# EAGLE design CMRI-Bus-Interface-L (EAGLE 7.7.0)
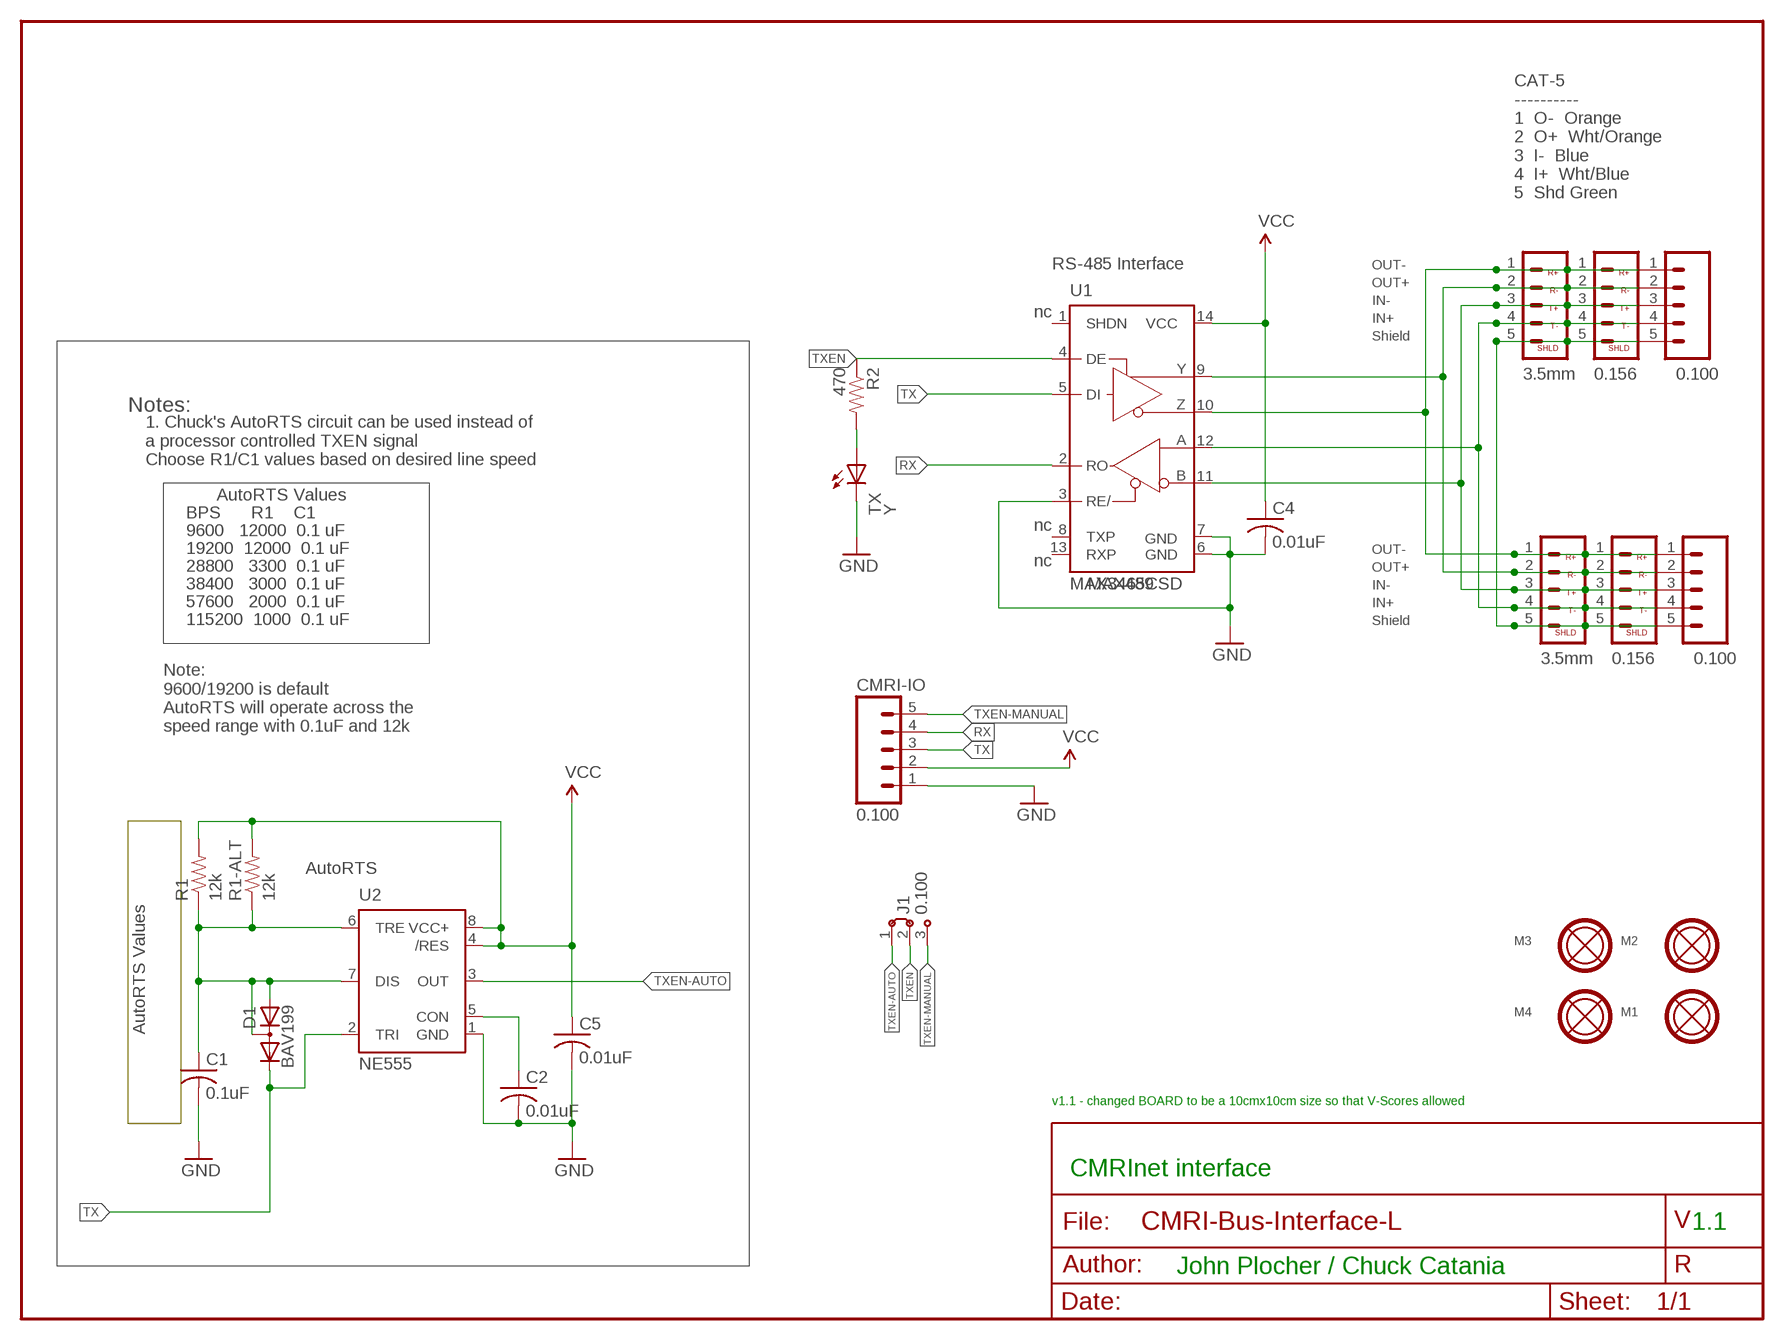
[diagram p0: schematic, sheet 1]

## Parts
C1  0.1uF  CAP0603  [0603-CAP]
C2  0.01uF  CAP0603  [0603-CAP]
C4  0.01uF  CAP0603  [0603-CAP]
C5  0.01uF  CAP0603  [0603-CAP]
CMRI-IO  0.100  CONNECTOR-M05CMRI  [1X05-CMRI-IO]
CMRINET1  3.5mm  CONNECTOR-CMRINET3.5MM  [CMRINET-3.5MM]
CMRINET2  3.5mm  CONNECTOR-CMRINET3.5MM  [CMRINET-3.5MM]
CMRINET3  0.156  CONNECTOR-CMRINET.156  [KK-156-5]
CMRINET4  0.156  CONNECTOR-CMRINET.156  [KK-156-5]
CON1  0.100  CONNECTOR-M05LOCK  [1X05_LOCK]
CON2  0.100  CONNECTOR-M05LOCK  [1X05_LOCK]
D1  BAV199  DIODE-BAV199  [SOT23]
J1  0.100  JUMPER-3-DEFAULT2.54MM  [J3-254]
M1  MOUNTINGHOLE  [MOUNTINGHOLE]
M2  MOUNTINGHOLE  [MOUNTINGHOLE]
M3  MOUNTINGHOLE  [MOUNTINGHOLE]
M4  MOUNTINGHOLE  [MOUNTINGHOLE]
R1  12k  RPTH04  [AXIAL-0.4-RES]
R1-ALT  12k  R0805-RES  [0805-RES]
R2  470  R0805-RES  [0805-RES]
TX  Y  LED0603-LED  [0603-LED]
U1  MAX3465CSD  [SO14]
U2  NE555  NE555D  [SO08]

## Nets
GND: C1.2 C2.2 C4.2 C5.2 CMRI-IO.1 TX.C U1.3(RE/) U1.6(GND) U1.7(GND) U2.1(GND)
IN+: CMRINET1.4 CMRINET2.4 CMRINET3.4 CMRINET4.4 CON1.4 CON2.4 U1.12(A)
IN-: CMRINET1.3 CMRINET2.3 CMRINET3.3 CMRINET4.3 CON1.3 CON2.3 U1.11(B)
N$29: R2.2 TX.A
N$38: C2.1 U2.5(CON)
N$52: C1.1 D1.1(A) D1.3(AC) R1-ALT.1 R1.P$1 U2.6(TRE) U2.7(DIS)
OUT+: CMRINET1.2 CMRINET2.2 CMRINET3.2 CMRINET4.2 CON1.2 CON2.2 U1.9(Y)
OUT-: CMRINET1.1 CMRINET2.1 CMRINET3.1 CMRINET4.1 CON1.1 CON2.1 U1.10(Z)
RX: CMRI-IO.4 U1.2(RO)
SHIELD: CMRINET1.5 CMRINET2.5 CMRINET3.5 CMRINET4.5 CON1.5 CON2.5
TX: CMRI-IO.3 D1.2(C) U1.5(DI) U2.2(TRI)
TXEN: J1.2 R2.1 U1.4(DE)
TXEN-AUTO: J1.1 U2.3(OUT)
TXEN-MANUAL: CMRI-IO.5 J1.3
VCC: C4.1 C5.1 CMRI-IO.2 R1-ALT.2 R1.P$2 U1.14(VCC) U2.4(/RES) U2.8(VCC+)
Unconnected: U1.1(SHDN) U1.8(TXP) U1.13(RXP)

## Notes on the sheet
- CAT-5
  ----------
  1  O-  Orange
  2  O+  Wht/Orange
  3  I-  Blue
  4  I+  Wht/Blue
  5  Shd Green
- RS-485 Interface | OUT-
- OUT+
- nc | IN-
- IN+
- Shield
- Notes:
- 1. Chuck's AutoRTS circuit can be used instead of 
  a processor controlled TXEN signal
  Choose R1/C1 values based on desired line speed
- AutoRTS Values
- BPS      R1    C1 | nc
- 9600   12000  0.1 uF
- 19200  12000  0.1 uF | nc | OUT-
- 28800   3300  0.1 uF | OUT+
- 38400   3000  0.1 uF | MAX489 | IN-
- 57600   2000  0.1 uF | IN+
- 115200  1000  0.1 uF | Shield
- Note: 
  9600/19200 is default
  AutoRTS will operate across the
  speed range with 0.1uF and 12k
- AutoRTS
- AutoRTS Values
- v1.1 - changed BOARD to be a 10cmx10cm size so that V-Scores allowed
- CMRInet interface
- 1.1
- John Plocher / Chuck Catania

## Library data of the parts
C1 C2 C4 C5 = SPCoast:CAP*
CMRI-IO CON1 CON2 = SPCoast:CONNECTOR-M05: Header 5 Standard 5-pin 0.1" header. Use with straight break away headers (SKU : PRT-00116), right angle break away headers (PRT-00553), swiss pins (PRT-00743), machine pins (PRT-00117), and female headers (PRT-00115). Molex polarized connector foot print use with SKU : PRT-08230 with associated crimp pins and housings.
CMRINET1-CMRINET4 = SPCoast:CONNECTOR-CMRINET: CMRINet Top 3.5mm Screw Terminal 5 pos
D1 = SPCoast:DIODE-BAV199: DIODE low-leakage double diode
J1 = SPCoast:JUMPER-3-DEFAULT: Jumper switch 2 x 2.5 mm
M1-M4 = SPCoast:MOUNTINGHOLE: Mounting hole with top and bottom copper and stop rings
R1 R1-ALT R2 = SPCoast:R*: Resistor Basic schematic elements and footprints for 0603, 1206, and PTH 1/10th watt (small) resistors.
TX = SPCoast:LED*
U1 = SPCoast:MAX346*: +5V, Fail-Safe, 40Mbps, Profibus RS-485/RS-422 Transceivers Source: MAX3465-MAX3469.pdf; MPN: MAX3465CSD+; OC_FARNELL: unknown; OC_NEWARK: 65K6814
U2 = SPCoast:NE555: General purpose bipolar Timer

## Board
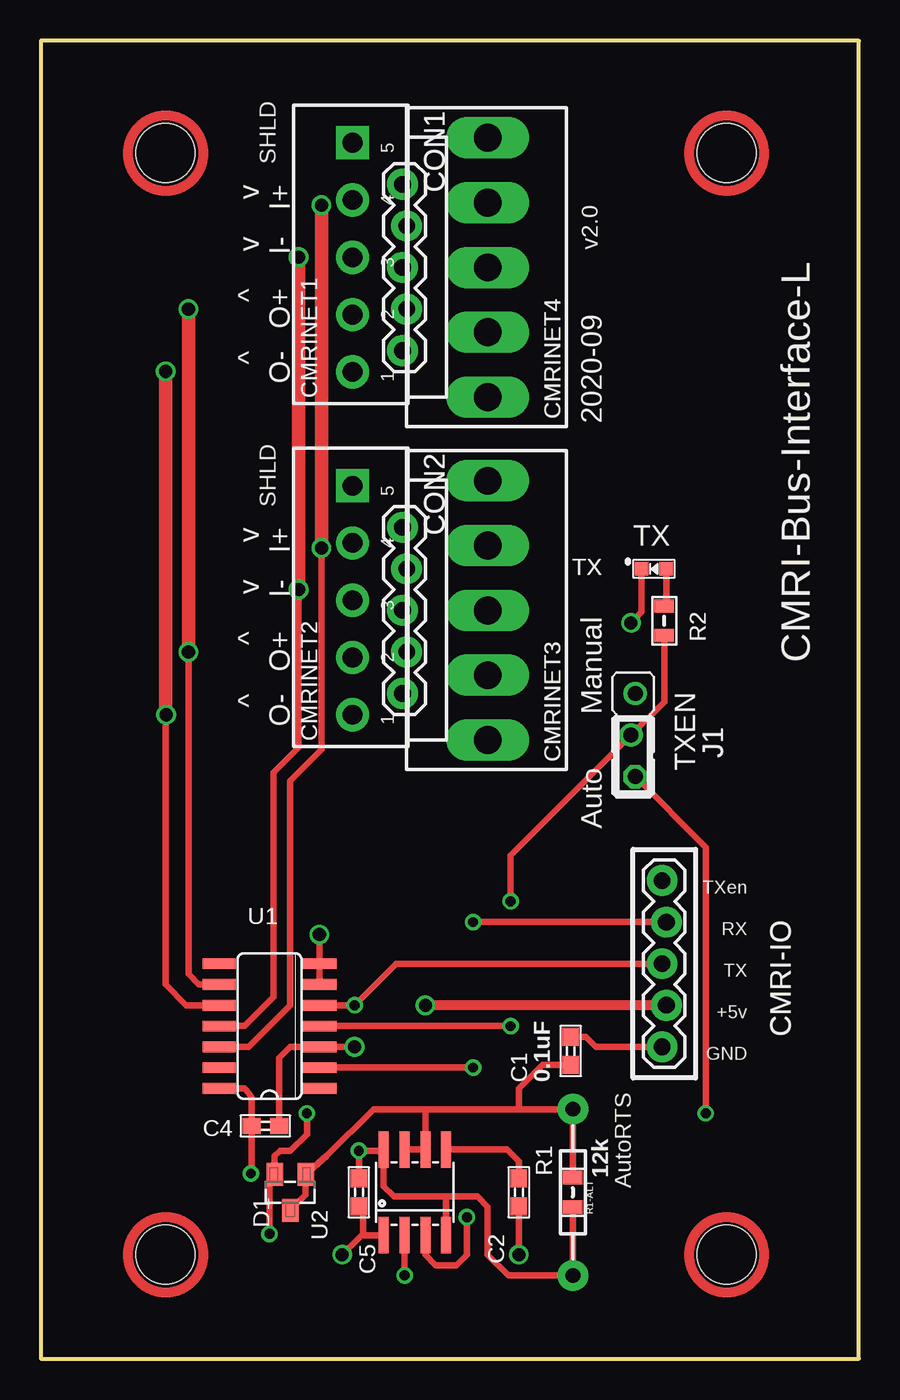
[diagram p1: board, top side]
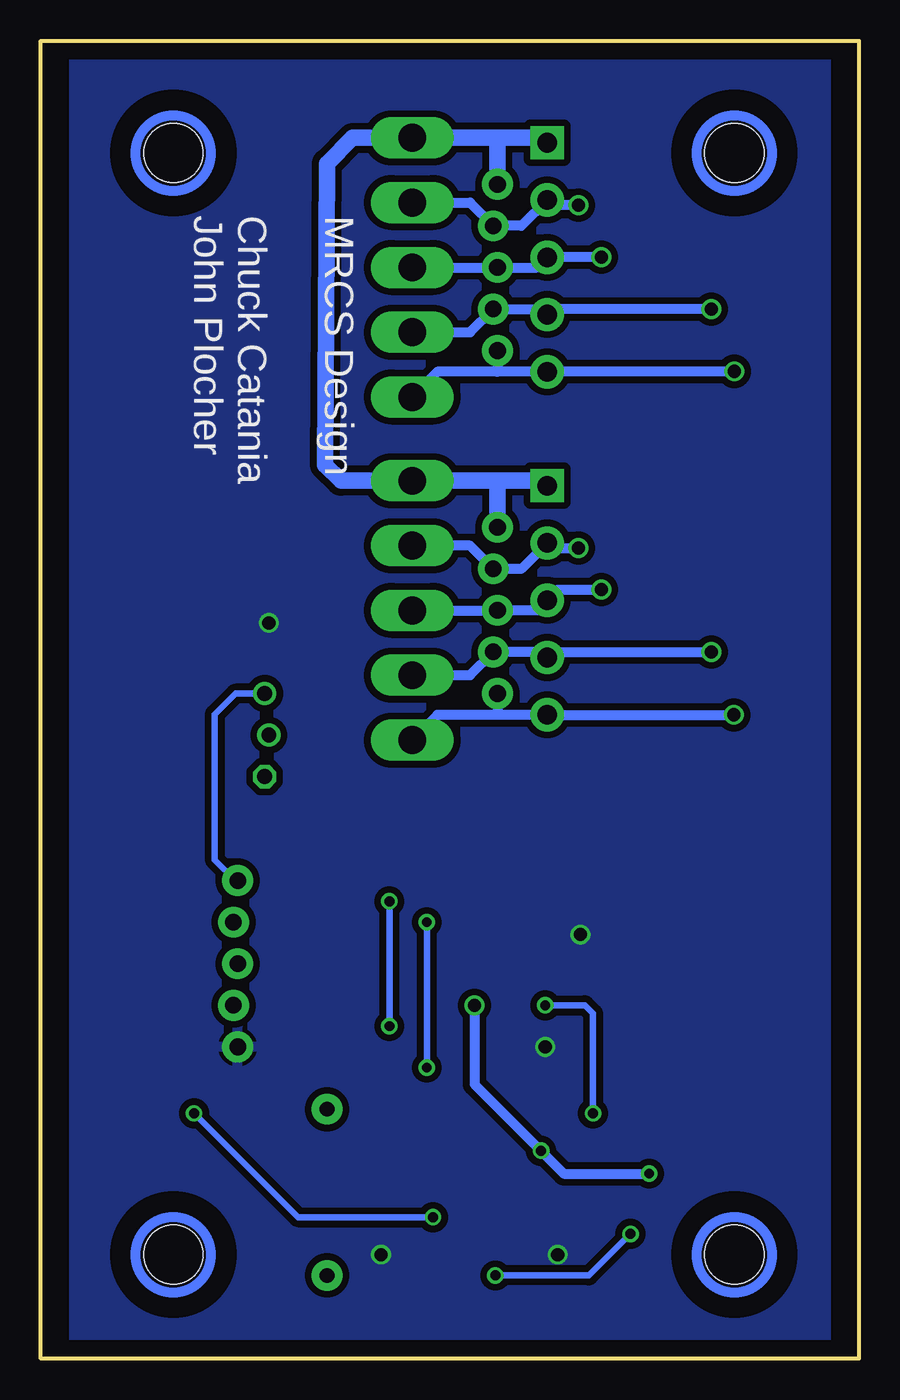
[diagram p2: board, bottom side, seen from below]

Size 50 x 80.52 mm. Coordinates in mm from the lower left corner, seen from the top.
Outline: 0,0 50,0 50,80.52 0,80.52 0,0
Copper layers (1*16): Top 0.035mm / dielectric 1.5mm / Bottom 0.035mm
Design rules "default": minimum track width 10mil, minimum drill 0.6mm, track to track 8mil, track to pad 8mil, pad to pad 8mil, via to via 8mil, smd to smd 8mil, copper to edge 40mil, drill to drill 8mil, minimum pad ring 10mil, minimum via ring 8mil, stop-mask expansion 4mil, vias tented up to drill 0mil, thermal gap 10mil

### Footprints (pad centres in the part's own frame; a part is rotated, then mirrored left to right if it is on the bottom)
0603-CAP = smd 1.1 x 1: 1 -0.85,0; 2 0.85,0
1X05-CMRI-IO = drill 1.016 pad 1.88: 1 0,0.127; 2 2.54,-0.127; 3 5.08,0.127; 4 7.62,-0.127; 5 10.16,0.127
CMRINET-3.5MM = drill 1.2 pad 2.032: 1 -6.38,0; 2 -2.88,0; 3 0.62,0; 4 4.12,0 | drill 1.2 pad 2.032 square: 5 7.62,0
KK-156-5 = drill 1.7 pad 2.184 long: 1 -7.92,0; 2 -3.96,0; 3 0,0; 4 3.96,0; 5 7.92,0
1X05_LOCK = drill 1.016 pad 1.88: 1 0,0.127; 2 2.54,-0.127; 3 5.08,0.127; 4 7.62,-0.127; 5 10.16,0.127
SOT23 = smd 1.4 x 1: 1 1.1,-0.95; 2 1.1,0.95; 3 -1.1,0
J3-254 = drill 0.914 octagon: 1 -2.54,-0.127 | drill 0.914: 2 0,0.127; 3 2.54,-0.127
MOUNTINGHOLE = hole 3.6: 0,0
AXIAL-0.4-RES = drill 0.9 pad 1.88: P$1 -5.08,0; P$2 5.08,0
0805-RES = smd 0.8 x 1.2: 1 -0.9,0; 2 0.9,0
0603-LED = smd 0.8 x 0.8: A 0.75,0; C -0.75,0
SO14 = smd 0.66 x 2.032: 1 -3.81,-3.073; 2 -2.54,-3.073; 3 -1.27,-3.073; 4 0,-3.073; 5 1.27,-3.073; 6 2.54,-3.073; 7 3.81,-3.073; 8 3.81,3.073; 9 2.54,3.073; 10 1.27,3.073; 11 0,3.073; 12 -1.27,3.073; 13 -2.54,3.073; 14 -3.81,3.073
SO08 = smd 0.61 x 2.21: 1 -1.905,-2.616; 2 -0.635,-2.616; 3 0.635,-2.616; 4 1.905,-2.616; 5 1.905,2.616; 6 0.635,2.616; 7 -0.635,2.616; 8 -1.905,2.616

### Placement (x,y rotation side)
C1  32.38,18.8 90 top
C2  29.21,10.16 270 top
C4  13.72,14.22 0 top
C5  19.43,10.16 270 top
CMRI-IO  38.1,19.05 90 top
CMRINET1  19.05,66.67 90 top
CMRINET2  19.05,45.72 90 top
CMRINET3  27.3,45.72 90 top
CMRINET4  27.3,66.67 90 top
CON1  22.23,61.59 90 top
CON2  22.23,40.64 90 top
D1  15.24,10.16 90 top
J1  36.2,38.1 90 top
M1  7.62,6.35 0 top
M2  7.62,73.66 0 top
M3  41.91,6.35 0 top
M4  41.91,73.66 0 top
R1  32.51,10.16 270 top
R1-ALT  32.51,10.16 270 top
R2  38.1,45.09 90 top
TX  37.47,48.26 0 top
U1  13.97,20.32 90 top
U2  22.86,10.16 0 top

### Tracks (layer width: path | path; a pad name or v marks a point on that pad's centre or on a via)
GND  (via drill 0.8)
  Top 0.406: U1.6 U1.7 17.04,25.41 17.04,25.9 17.04,25.91 v17.02,25.91 | C2.2 v29.21,6.35 | C5.2 19.7,9.31 19.7,7.61 19.76,7.54 | U2.1 19.76,7.54 | 19.76,7.54 19.61,7.54 v18.41,6.35 | C1.2 33.31,19.65 33.91,19.05 CMRI-IO.1 | v19.18,19.05 U1.3 15.24,19.05 14.57,18.38 C4.2 | TX.C 36.72,45.6 v36.07,44.96
  pour Bottom (isolate 0.406): 2,80.52 48,80.52 48,0 2,0
IN+  (via drill 0.8)
  Top 0.406: U1.12 12.7,19.05 15.24,21.59 15.24,35.31 17.14,37.21 v17.14,49.53
  Top 0.813: v17.14,49.53 v17.14,70.48
  Bottom 0.61: v17.14,70.48 18.74,70.48 CMRINET1.4 20.63,69.22 CON1.4 23.77,70.64 CMRINET4.4 | v17.14,49.53 18.74,49.53 CMRINET2.4 20.63,48.26 CON2.4 23.77,49.68 CMRINET3.4
IN-  (via drill 0.8)
  Top 0.406: U1.11 12.45,20.32 14.22,22.1 14.22,35.81 15.75,37.34 v15.75,46.99
  Top 0.813: v15.75,46.99 v15.75,67.31
  Bottom 0.61: v15.75,67.31 19.04,67.31 CMRINET1.3 19.67,66.67 CON1.3 CMRINET4.3 | v15.75,46.99 18.4,46.99 CMRINET2.3 19.67,45.72 CON2.3 CMRINET3.3
N$29
  Top 0.406: TX.A 38.22,46.1 R2.2
N$38
  Top 0.406: U2.5 28.5,12.78 29.21,12.06 C2.1
N$52
  Top 0.406: U2.7 U2.6 23.5,15.24 | 23.5,15.24 29.21,15.24 | 29.21,15.24 R1.P$1 R1-ALT.1 | 23.5,15.24 20.32,15.24 17.46,12.38 D1.1 16.19,10.01 D1.3 | 32.51,17.95 C1.1 30.65,17.95 29.21,16.51 29.21,15.24
OUT+  (via drill 0.8)
  Top 0.406: U1.9 9.65,22.86 9.02,23.5 v9.02,43.18
  Top 0.813: v9.02,43.18 v9.02,64.14
  Bottom 0.406: CMRINET2.2 18.71,43.18
  Bottom 0.61: v9.02,64.14 18.71,64.14 CMRINET1.2 19.39,64.14 CON1.2 23.77,62.72 CMRINET4.2 | 18.71,43.18 v9.02,43.18 | CMRINET2.2 19.39,43.18 CON2.2 23.77,41.76 CMRINET3.2
OUT-  (via drill 0.8)
  Top 0.406: U1.10 8.89,21.59 7.62,22.86 7.62,39.37 v7.65,39.34
  Top 0.813: 7.62,39.37 v7.62,60.33
  Bottom 0.61: v7.62,60.33 CMRINET1.1 22.1,60.3 | v7.65,39.34 CMRINET2.1 22.1,39.34 | 22.1,60.3 25.77,60.3 CMRINET4.1 | CON1.1 22.1,60.3 | 22.1,39.34 25.77,39.34 CMRINET3.1 | CON2.1 22.1,39.34
RX  (via drill 0.6)
  Top 0.406: U1.2 v26.42,17.78 | v26.42,26.67 CMRI-IO.4
  Bottom 0.406: v26.42,17.78 v26.42,26.67
SHIELD
  Bottom 1.016: CMRINET1.5 19.35,74.59 22.1,74.59 | 22.1,74.59 CMRINET4.5 30.94,74.59 32.51,73.03 32.64,54.61 31.67,53.64 CMRINET3.5 22.1,53.64 | CON1.5 22.1,74.59 | CMRINET2.5 19.05,53.64 22.1,53.64 | CON2.5 22.1,53.64
TX  (via drill 0.6)
  Top 0.406: U1.5 v19.18,21.59 21.72,24.13 CMRI-IO.3 | v13.97,7.62 13.97,10.79 14.29,11.12 D1.2 14.29,12.38 14.61,12.7 15.24,12.7 16.26,13.72 v16.26,14.99 | v22.23,5.08 U2.2
  Bottom 0.406: v13.97,7.62 16.51,5.08 v22.23,5.08 | v19.18,21.59 16.76,21.59 16.26,21.08 v16.26,14.99
TXEN  (via drill 0.6)
  Top 0.406: U1.4 v28.7,20.32 | R2.1 38.1,40.13 J1.2 28.7,30.73 v28.7,27.94
  Bottom 0.406: v28.7,20.32 v28.7,27.94
TXEN-AUTO  (via drill 0.6)
  Top 0.406: v26.04,8.64 26.04,6.35 25.4,5.71 24.13,5.71 23.5,6.35 U2.3 | v40.64,14.99 40.64,31.24 J1.1
  Bottom 0.406: v40.64,14.99 34.29,8.64 v26.04,8.64
TXEN-MANUAL
  Bottom 0.406: J1.3 38.1,40.64 39.37,39.37 39.37,30.48 38.1,29.21 CMRI-IO.5
VCC  (via drill 0.6, 0.8)
  Top 0.254: 24.77,8.26 U2.4
  Top 0.406: C5.1 v19.43,12.7 20.88,12.7 U2.8 20.95,10.54 21.59,9.91 24.77,9.91 | 24.77,9.91 U2.4 | 24.77,9.91 26.67,9.91 27.3,9.27 27.3,6.35 28.57,5.08 R1.P$2 R1-ALT.2 | U1.14 12.45,16.51 12.57,16.38 12.87,15.96 C4.1 12.87,11.34 v12.83,11.3
  Top 0.61: CMRI-IO.2 v23.5,21.59
  Bottom 0.61: v12.83,11.3 18.03,11.3 v19.43,12.7 23.5,16.76 v23.5,21.59

### Text on the board
tPlace: v2.0 | 2020-09 | TX | Manual | TXEN | Auto | AutoRTS
bPlace: MRCS Design / / Chuck Catania / John Plocher
_tPlace: C1 | R1
_tNames: CON1 | CMRINET1 | CMRINET4 | CON2 | TX | CMRINET2 | CMRINET3 | R2 | J1 | U1 | CMRI-IO | C4 | R1-ALT | D1 | C2 | U2 | C5